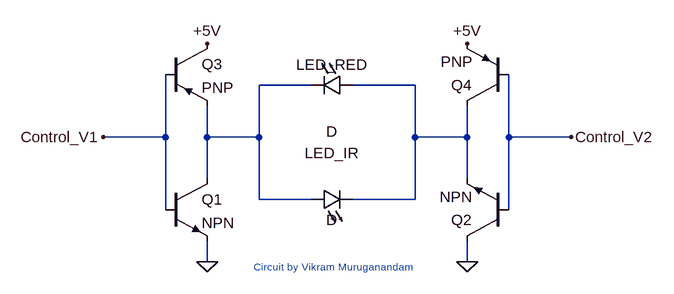
[diagram p0: schematic Draft1.asc]
Draft1.asc, the LTspice schematic file:
Version 4
SHEET 1 880 680
WIRE 160 128 80 128
WIRE 320 128 224 128
WIRE -64 208 -64 112
WIRE -64 208 -160 208
WIRE 0 208 0 160
WIRE 80 208 80 128
WIRE 80 208 0 208
WIRE 320 208 320 128
WIRE 400 208 400 160
WIRE 400 208 320 208
WIRE 464 208 464 112
WIRE 560 208 464 208
WIRE 0 272 0 208
WIRE 400 272 400 208
WIRE 80 304 80 208
WIRE 160 304 80 304
WIRE 320 304 320 208
WIRE 320 304 224 304
WIRE -64 320 -64 208
WIRE 464 320 464 208
WIRE 0 400 0 368
WIRE 400 400 400 368
FLAG 400 400 0
FLAG 0 400 0
FLAG -160 208 Control_V1
FLAG 560 208 Control_V2
FLAG 0 64 +5V
FLAG 400 64 +5V
SYMBOL LED 224 112 R90
WINDOW 0 0 32 VBottom 2
WINDOW 3 72 32 VTop 2
SYMATTR InstName LED_RED
SYMBOL LED 160 320 R270
WINDOW 0 72 32 VTop 2
WINDOW 3 0 32 VBottom 2
SYMATTR InstName LED_IR
SYMBOL npn -64 272 R0
SYMATTR InstName Q1
SYMBOL npn 464 368 R180
SYMATTR InstName Q2
SYMBOL pnp -64 64 R0
SYMATTR InstName Q3
SYMBOL pnp 464 160 R180
SYMATTR InstName Q4
TEXT 72 408 Left 1 ;Circuit by Vikram Muruganandam

The netlist it stands for:
* Draft1.asc
D§LED_RED N002 N001 D
D§LED_IR N001 N002 D
Q1 N001 Control_V1 0 0 NPN
Q2 0 Control_V2 N002 0 NPN
Q3 +5V Control_V1 N001 0 PNP
Q4 N002 Control_V2 +5V 0 PNP
.model D D
.lib standard.dio
.model NPN NPN
.model PNP PNP
.lib standard.bjt
* Circuit by Vikram Muruganandam
.backanno
.end